# Altium schematic sheet mistake.SchDoc
size B
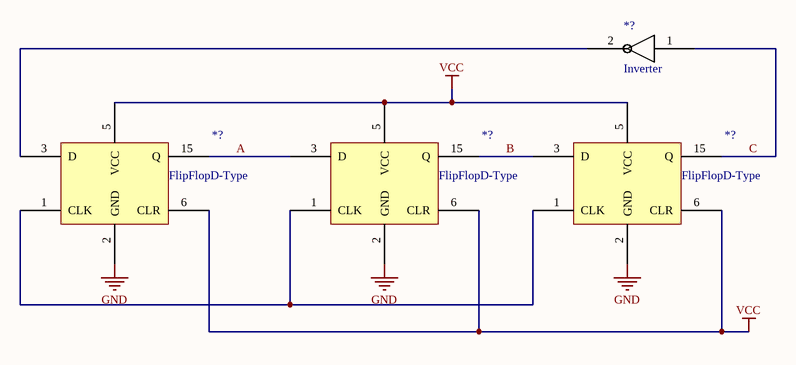
[diagram p0: mistake.SchDoc]

## Parts
(Parts that share a designator on the sheet are numbered #1, #2 ... from top to bottom, then left to right.)
*?#1  Inverter
*?#2  FlipFlopD-Type
*?#3  FlipFlopD-Type
*?#4  FlipFlopD-Type

## Nets
GND: *?#2.2(GND) *?#3.2(GND) *?#4.2(GND)
VCC: *?#2.5(VCC) *?#2.6(CLR) *?#3.5(VCC) *?#3.6(CLR) *?#4.5(VCC) *?#4.6(CLR)
A: *?#2.15(Q) *?#3.3(D)
B: *?#3.15(Q) *?#4.3(D)
C: *?#1.1 *?#4.15(Q)
Net*?#1_2: *?#1.2 *?#2.3(D)
Net*?#2_1: *?#2.1(CLK) *?#3.1(CLK) *?#4.1(CLK)